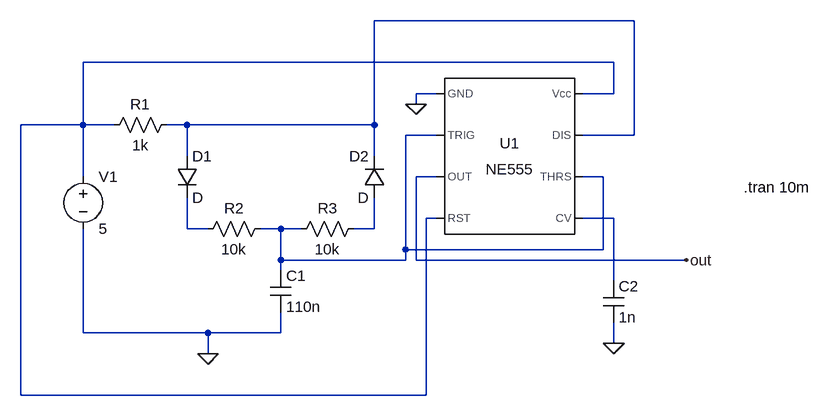
[diagram p0: schematic PWMGenerator_with555Timer.asc]
PWMGenerator_with555Timer.asc, the LTspice schematic file:
Version 4
SHEET 1 1068 680
WIRE 784 -32 384 -32
WIRE 752 32 -64 32
WIRE 480 80 448 80
WIRE 752 80 752 32
WIRE 752 80 704 80
WIRE 448 96 448 80
WIRE -64 128 -64 32
WIRE -64 128 -160 128
WIRE -16 128 -64 128
WIRE 96 128 64 128
WIRE 384 128 384 -32
WIRE 384 128 96 128
WIRE 480 144 432 144
WIRE 784 144 784 -32
WIRE 784 144 704 144
WIRE 96 176 96 128
WIRE 384 176 384 128
WIRE -64 208 -64 128
WIRE 480 208 448 208
WIRE 736 208 704 208
WIRE 480 272 464 272
WIRE 752 272 704 272
WIRE 96 288 96 240
WIRE 128 288 96 288
WIRE 240 288 208 288
WIRE 272 288 240 288
WIRE 384 288 384 240
WIRE 384 288 352 288
WIRE 432 320 432 144
WIRE 736 320 736 208
WIRE 736 320 432 320
WIRE 240 336 240 288
WIRE 432 336 432 320
WIRE 432 336 240 336
WIRE 448 336 448 208
WIRE 864 336 448 336
WIRE 240 352 240 336
WIRE 752 368 752 272
WIRE -64 448 -64 288
WIRE 128 448 -64 448
WIRE 240 448 240 416
WIRE 240 448 128 448
WIRE 752 464 752 432
WIRE 128 480 128 448
WIRE -160 544 -160 128
WIRE 464 544 464 272
WIRE 464 544 -160 544
FLAG 128 480 0
FLAG 448 96 0
FLAG 864 336 out
FLAG 752 464 0
SYMBOL res 80 112 R90
WINDOW 0 0 56 VBottom 2
WINDOW 3 32 56 VTop 2
SYMATTR InstName R1
SYMATTR Value 1k
SYMBOL diode 80 176 R0
SYMATTR InstName D1
SYMBOL diode 400 240 R180
WINDOW 0 24 64 Left 2
WINDOW 3 24 0 Left 2
SYMATTR InstName D2
SYMBOL cap 224 352 R0
SYMATTR InstName C1
SYMATTR Value 110n
SYMBOL cap 736 368 R0
SYMATTR InstName C2
SYMATTR Value 1n
SYMBOL voltage -64 192 R0
SYMATTR InstName V1
SYMATTR Value 5
SYMBOL Misc\\NE555 592 176 R0
SYMATTR InstName U1
SYMBOL res 224 272 R90
WINDOW 0 0 56 VBottom 2
WINDOW 3 32 56 VTop 2
SYMATTR InstName R2
SYMATTR Value 10k
SYMBOL res 368 272 R90
WINDOW 0 0 56 VBottom 2
WINDOW 3 32 56 VTop 2
SYMATTR InstName R3
SYMATTR Value 10k
TEXT 952 224 Left 2 !.tran 10m

The netlist it stands for:
* PWMGenerator_with555Timer.asc
R1 N001 N002 1k
D1 N001 N005 D
D2 N006 N001 D
C1 N003 0 110n
C2 N004 0 1n
V1 N002 0 5
XU1 0 N003 out N002 N004 N003 N001 N002 NE555  ; pins GND TRIG OUT RST CV THRS DIS Vcc
R2 N003 N005 10k
R3 N006 N003 10k
.model D D
.lib standard.dio
.tran 10m
.lib NE555.sub
.backanno
.end